# Altium schematic sheet Analog Input.SchDoc: Motor Vibration
size A4; Organization: NTUST EE-305; Address1: No.43, Sec. 4, Keelung Rd.; Address2: Da’an Dist.; Address3: Taipei 106; Address4: Taiwan (R.O.C.); DocumentNumber: 1; Revision: 3.0; SheetNumber: 7; SheetTotal: 9
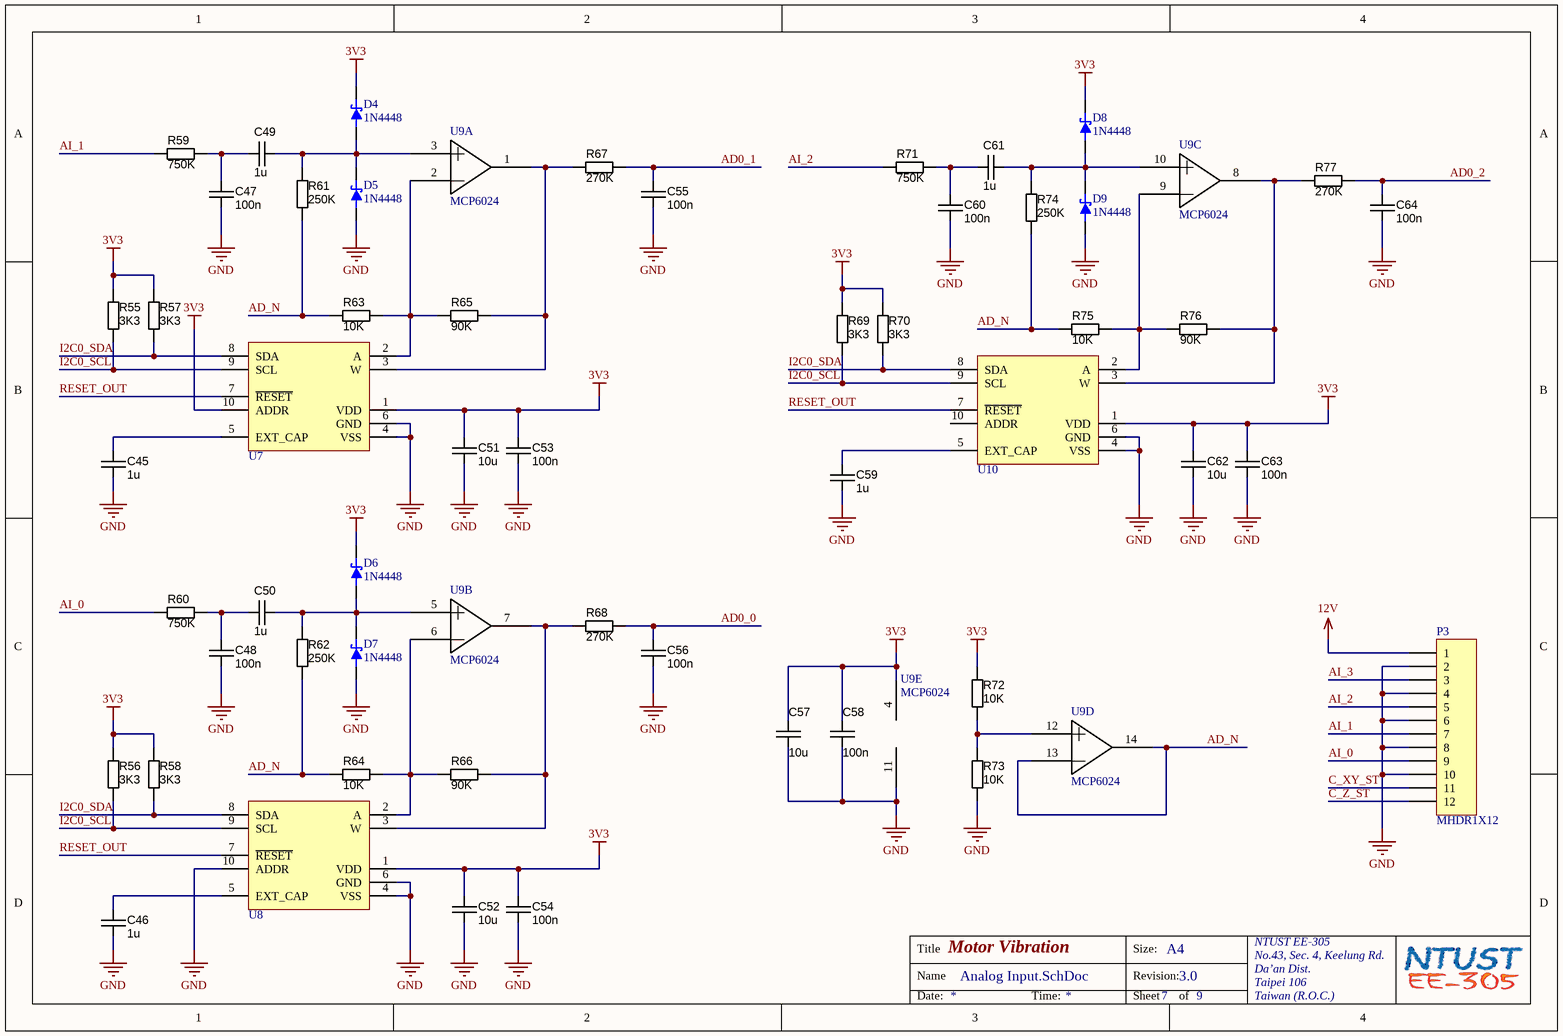
[diagram p0: Analog Input.SchDoc]

## Parts
C45  1u  [CAPC1608N]
C46  1u  [CAPC1608N]
C47  100n  [CAPC1005N]
C48  100n  [CAPC1005N]
C49  1u  [CAPC1608N]
C50  1u  [CAPC1608N]
C51  10u  [CAPC2012N]
C52  10u  [CAPC2012N]
C53  100n  [CAPC1005N]
C54  100n  [CAPC1005N]
C55  100n  [CAPC1005N]
C56  100n  [CAPC1005N]
C57  10u  [CAPC2012N]
C58  100n  [CAPC1005N]
C59  1u  [CAPC1608N]
C60  100n  [CAPC1005N]
C61  1u  [CAPC1608N]
C62  10u  [CAPC2012N]
C63  100n  [CAPC1005N]
C64  100n  [CAPC1005N]
D4  1N4448  [SOD323]
D5  1N4448  [SOD323]
D6  1N4448  [SOD323]
D7  1N4448  [SOD323]
D8  1N4448  [SOD323]
D9  1N4448  [SOD323]
P3  MHDR1X12  [MHDR1X12]
R55  3K3  [RESC1005N]
R56  3K3  [RESC1005N]
R57  3K3  [RESC1005N]
R58  3K3  [RESC1005N]
R59  750K  [RESC1005N]
R60  750K  [RESC1005N]
R61  250K  [RESC1005N]
R62  250K  [RESC1005N]
R63  10K  [RESC1005N]
R64  10K  [RESC1005N]
R65  90K  [RESC1005N]
R66  90K  [RESC1005N]
R67  270K  [RESC1005N]
R68  270K  [RESC1005N]
R69  3K3  [RESC1005N]
R70  3K3  [RESC1005N]
R71  750K  [RESC1005N]
R72  10K  [RESC1005N]
R73  10K  [RESC1005N]
R74  250K  [RESC1005N]
R75  10K  [RESC1005N]
R76  90K  [RESC1005N]
R77  270K  [RESC1005N]
U7  100k  [MSOP-UN10_L]  (value not drawn)
U8  100k  [MSOP-UN10_L]  (value not drawn)
U9  MCP6024  [MCHP-TSSOP-ST14_L]  (parts A,B,C,D,E of 5)
U10  100k  [MSOP-UN10_L]  (value not drawn)

## Nets
3V3: C51.1 C52.1 C53.1 C54.1 C57.1 C58.1 C62.1 C63.1 D4.1(cathode) D6.1(cathode) D8.1(cathode) R55.1 R56.1 R57.1 R58.1 R69.1 R70.1 R72.1 U7.1(VDD) U7.10(ADDR) U8.1(VDD) U9.4(VDD) U10.1(VDD)
12V: P3.1
GND: C45.2 C46.2 C47.2 C48.2 C51.2 C52.2 C53.2 C54.2 C55.2 C56.2 C57.2 C58.2 C59.2 C60.2 C62.2 C63.2 C64.2 D5.2(anode) D7.2(anode) D9.2(anode) P3.2 P3.4 P3.6 P3.8 P3.10 R73.2 U7.4(VSS) U7.6(GND) U8.4(VSS) U8.6(GND) U8.10(ADDR) U9.11(GND) U10.4(VSS) U10.6(GND)
AD0_0: C56.1 R68.2
AD0_1: C55.1 R67.2
AD0_2: C64.1 R77.2
AD_N: R61.2 R62.2 R63.1 R64.1 R74.2 R75.1 U9.13(VIND-) U9.14(VOUTD)
AI_0: P3.9 R60.1
AI_1: P3.7 R59.1
AI_2: P3.5 R71.1
AI_3: P3.3
C_XY_ST: P3.11
C_Z_ST: P3.12
I2C0_SCL: R55.2 R56.2 R69.2 U7.9(SCL) U8.9(SCL) U10.9(SCL)
I2C0_SDA: R57.2 R58.2 R70.2 U7.8(SDA) U8.8(SDA) U10.8(SDA)
RESET_OUT: U7.7(~{RESET}) U8.7(~{RESET}) U10.7(~{RESET})
NetC45_1: C45.1 U7.5(EXT_CAP)
NetC46_1: C46.1 U8.5(EXT_CAP)
NetC47_1: C47.1 C49.1 R59.2
NetC48_1: C48.1 C50.1 R60.2
NetC49_2: C49.2 D4.2(anode) D5.1(cathode) R61.1 U9.3(VINA+)
NetC50_2: C50.2 D6.2(anode) D7.1(cathode) R62.1 U9.5(VINB+)
NetC59_1: C59.1 U10.5(EXT_CAP)
NetC60_1: C60.1 C61.1 R71.2
NetC61_2: C61.2 D8.2(anode) D9.1(cathode) R74.1 U9.10(VINC+)
NetR63_2: R63.2 R65.1 U7.2(A) U9.2(VINA-)
NetR64_2: R64.2 R66.1 U8.2(A) U9.6(VINB-)
NetR65_2: R65.2 R67.1 U7.3(W) U9.1(VOUTA)
NetR66_2: R66.2 R68.1 U8.3(W) U9.7(VOUTB)
NetR72_2: R72.2 R73.1 U9.12(VIND+)
NetR75_2: R75.2 R76.1 U9.9(VINC-) U10.2(A)
NetR76_2: R76.2 R77.1 U9.8(VOUTC) U10.3(W)

Not connected (* = marked no-connect by the designer): U10 10(ADDR)

## Notes on the sheet
- Title
- Name
- Size:
- Revision:
- A4
- Date:
- Time:
- Sheet
- of

## Library data of the parts
C45 C46 C49-C52 C57 C59 C61 C62 = Capacitor SMD Cer X5R: Manufacturer 1: Kemet; Manufacturer Part Number 1: C0805C104K5RACTU; Tolerance: ?0%; Ratings: 50V; X7R; Material: ceramic; Package / Case: 0805 (2012 metric); Supplier 1: Digi-Key; Supplier Part Number 1: 399-1170-1-ND
  C45 C46 C49 C50 C59 C61: Value: 1u
  C51 C52 C57 C62: Value: 10u
C47 C48 C53-C56 C58 C60 C63 C64 = Capacitor SMD Cer X7R: Manufacturer 1: Kemet; Manufacturer Part Number 1: C0805C104K5RACTU; Tolerance: ?0%; Ratings: 50V; X7R; Material: ceramic; Package / Case: 0805 (2012 metric); Supplier 1: Digi-Key; Supplier Part Number 1: 399-1170-1-ND; Value: 100n
D4-D9 = 1N4448: SURFACE MOUNT FAST SWITCHING DIODE; Supplier 1: Digi-Key; Supplier Part Number 1: 1N4448HWS-FDICT-ND
P3 = MHDR1X12: Header, 12-Pin; LatestRevisionDate: 17-Jul-2002; LatestRevisionNote: Re-released for DXP Platform.; Publisher: Altium Limited
R55-R77 = Resistor SMD chip: Manufacturer 1: Yageo; Manufacturer Part Number 1: RC0805JR-0710KL; Ratings: 1/8 W; Tolerance: ?%; Package / Case: 0805 (2012 metric); Material: Thick Film; Supplier 1: Digi-Key; Supplier Part Number 1: 311-10KARCT-ND
  R55-R58 R69 R70: Value: 3K3
  R59 R60 R71: Value: 750K
  R61 R62 R74: Value: 250K
  R63 R64 R72 R73 R75: Value: 10K
  R65 R66 R76: Value: 90K
  R67 R68 R77: Value: 270K
U7 U8 U10 = AD5272: 1024-/256-Position, 1% Resistor Tolerance Error,   I2C Interface and 50-TP Memory Digital Rheostat; Value: 100k; Supplier 1: Digi-Key; Supplier Part Number 1: AD5272BRMZ-100-ND
U9 = MCP6024: Rail-to-Rail Input/Output, 10 MHz Op Amps; Supplier 1: Digi-Key; Supplier Part Number 1: MCP6024-E/ST-ND